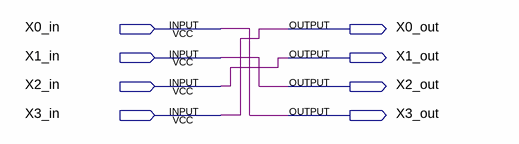
[diagram p0: schematic sheet]
// Quartus schematic signal_decoder.bdf as structural Verilog: 0 symbols, 8 pins
module signal_decoder (
  input  X0_in,
  input  X1_in,
  input  X2_in,
  input  X3_in,
  output X0_out,
  output X1_out,
  output X2_out,
  output X3_out
);


  assign X0_out = X3_in;
  assign X1_out = X2_in;
  assign X2_out = X1_in;
  assign X3_out = X0_in;
endmodule
